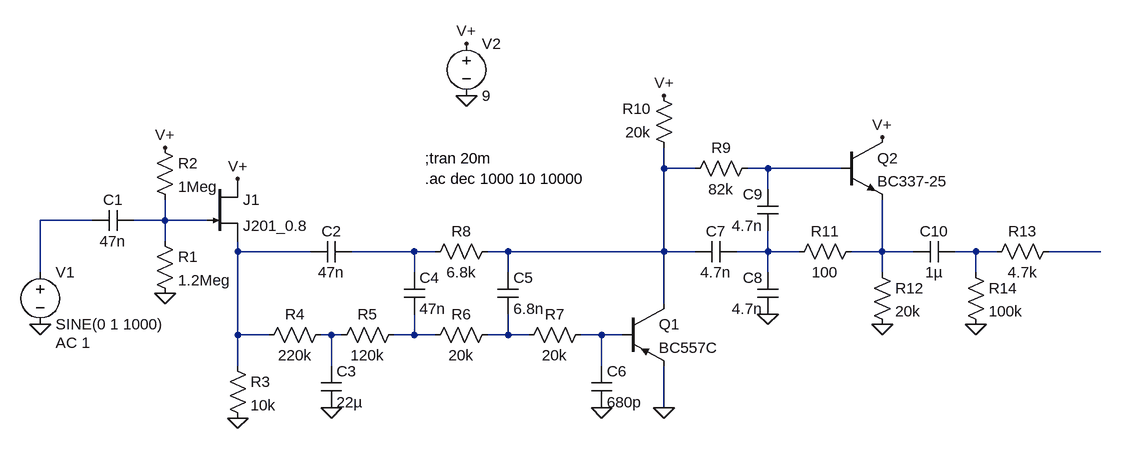
[diagram p0: schematic lart_simple.asc]
lart_simple.asc, the LTspice schematic file:
Version 4
SHEET 1 1700 680
WIRE 1008 -16 1008 -48
WIRE 1056 -16 1008 -16
WIRE 1168 -16 1136 -16
WIRE 1280 -16 1168 -16
WIRE 1168 16 1168 -16
WIRE 128 64 48 64
WIRE 240 64 240 32
WIRE 240 64 192 64
WIRE 304 64 240 64
WIRE 240 96 240 64
WIRE 352 112 352 96
WIRE 464 112 352 112
WIRE 624 112 528 112
WIRE 656 112 624 112
WIRE 768 112 736 112
WIRE 1008 112 1008 -16
WIRE 1008 112 768 112
WIRE 1056 112 1008 112
WIRE 1168 112 1168 80
WIRE 1168 112 1120 112
WIRE 1216 112 1168 112
WIRE 1344 112 1344 32
WIRE 1344 112 1296 112
WIRE 1392 112 1344 112
WIRE 1488 112 1456 112
WIRE 1520 112 1488 112
WIRE 1680 112 1600 112
WIRE 48 144 48 64
WIRE 624 144 624 112
WIRE 768 144 768 112
WIRE 1168 144 1168 112
WIRE 1344 144 1344 112
WIRE 1488 144 1488 112
WIRE 1008 192 1008 112
WIRE 352 240 352 112
WIRE 400 240 352 240
WIRE 496 240 480 240
WIRE 512 240 496 240
WIRE 624 240 624 208
WIRE 624 240 592 240
WIRE 656 240 624 240
WIRE 768 240 768 208
WIRE 768 240 736 240
WIRE 800 240 768 240
WIRE 912 240 880 240
WIRE 944 240 912 240
WIRE 352 288 352 240
WIRE 496 288 496 240
WIRE 912 288 912 240
WIRE 1008 352 1008 288
FLAG 48 224 0
FLAG 240 -48 V+
FLAG 352 0 V+
FLAG 1008 -128 V+
FLAG 1344 -64 V+
FLAG 1488 224 0
FLAG 1344 224 0
FLAG 1168 208 0
FLAG 912 352 0
FLAG 1008 352 0
FLAG 496 352 0
FLAG 352 368 0
FLAG 240 176 0
FLAG 704 -208 V+
FLAG 704 -128 0
SYMBOL voltage 48 128 R0
WINDOW 123 24 124 Left 2
WINDOW 39 0 0 Left 2
SYMATTR InstName V1
SYMATTR Value SINE(0 1 1000)
SYMATTR Value2 AC 1
SYMBOL cap 192 48 R90
WINDOW 0 0 32 VBottom 2
WINDOW 3 32 32 VTop 2
SYMATTR InstName C1
SYMATTR Value 47n
SYMBOL res 224 80 R0
SYMATTR InstName R1
SYMATTR Value 1.2Meg
SYMBOL res 224 -64 R0
SYMATTR InstName R2
SYMATTR Value 1Meg
SYMBOL njf 304 0 R0
SYMATTR InstName J1
SYMATTR Value J201_0.8
SYMBOL res 336 272 R0
SYMATTR InstName R3
SYMATTR Value 10k
SYMBOL cap 528 96 R90
WINDOW 0 0 32 VBottom 2
WINDOW 3 32 32 VTop 2
SYMATTR InstName C2
SYMATTR Value 47n
SYMBOL res 496 224 R90
WINDOW 0 0 56 VBottom 2
WINDOW 3 32 56 VTop 2
SYMATTR InstName R4
SYMATTR Value 220k
SYMBOL res 608 224 R90
WINDOW 0 0 56 VBottom 2
WINDOW 3 32 56 VTop 2
SYMATTR InstName R5
SYMATTR Value 120k
SYMBOL cap 480 288 R0
SYMATTR InstName C3
SYMATTR Value 22µ
SYMBOL cap 608 144 R0
SYMATTR InstName C4
SYMATTR Value 47n
SYMBOL res 752 224 R90
WINDOW 0 0 56 VBottom 2
WINDOW 3 32 56 VTop 2
SYMATTR InstName R6
SYMATTR Value 20k
SYMBOL res 896 224 R90
WINDOW 0 0 56 VBottom 2
WINDOW 3 32 56 VTop 2
SYMATTR InstName R7
SYMATTR Value 20k
SYMBOL cap 752 144 R0
SYMATTR InstName C5
SYMATTR Value 6.8n
SYMBOL res 752 96 R90
WINDOW 0 0 56 VBottom 2
WINDOW 3 32 56 VTop 2
SYMATTR InstName R8
SYMATTR Value 6.8k
SYMBOL cap 896 288 R0
SYMATTR InstName C6
SYMATTR Value 680p
SYMBOL pnp 944 192 R0
SYMATTR InstName Q1
SYMATTR Value BC557C
SYMBOL cap 1120 96 R90
WINDOW 0 0 32 VBottom 2
WINDOW 3 32 32 VTop 2
SYMATTR InstName C7
SYMATTR Value 4.7n
SYMBOL cap 1184 208 R180
WINDOW 0 24 56 Left 2
WINDOW 3 24 8 Left 2
SYMATTR InstName C8
SYMATTR Value 4.7n
SYMBOL cap 1184 80 R180
WINDOW 0 24 56 Left 2
WINDOW 3 24 8 Left 2
SYMATTR InstName C9
SYMATTR Value 4.7n
SYMBOL res 1152 -32 R90
WINDOW 0 0 56 VBottom 2
WINDOW 3 32 56 VTop 2
SYMATTR InstName R9
SYMATTR Value 82k
SYMBOL res 1024 -32 R180
WINDOW 0 36 76 Left 2
WINDOW 3 36 40 Left 2
SYMATTR InstName R10
SYMATTR Value 20k
SYMBOL res 1312 96 R90
WINDOW 0 0 56 VBottom 2
WINDOW 3 32 56 VTop 2
SYMATTR InstName R11
SYMATTR Value 100
SYMBOL npn 1280 -64 R0
SYMATTR InstName Q2
SYMATTR Value BC337-25
SYMBOL res 1328 128 R0
SYMATTR InstName R12
SYMATTR Value 20k
SYMBOL cap 1456 96 R90
WINDOW 0 0 32 VBottom 2
WINDOW 3 32 32 VTop 2
SYMATTR InstName C10
SYMATTR Value 1µ
SYMBOL res 1616 96 R90
WINDOW 0 0 56 VBottom 2
WINDOW 3 32 56 VTop 2
SYMATTR InstName R13
SYMATTR Value 4.7k
SYMBOL res 1472 128 R0
SYMATTR InstName R14
SYMATTR Value 100k
SYMBOL voltage 704 -224 R0
WINDOW 123 0 0 Left 2
WINDOW 39 0 0 Left 2
SYMATTR InstName V2
SYMATTR Value 9
TEXT 640 -32 Left 2 !;tran 20m
TEXT 640 0 Left 2 !.ac dec 1000 10 10000

The netlist it stands for:
* lart_simple.asc
V1 N003 0 SINE(0 1 1000) AC 1
C1 N004 N003 47n
R1 N004 0 1.2Meg
R2 V+ N004 1Meg
J1 V+ N004 N005 J201_0.8
R3 N005 0 10k
C2 N006 N005 47n
R4 N011 N005 220k
R5 N012 N011 120k
C3 N011 0 22µ
C4 N006 N012 47n
R6 N013 N012 20k
R7 N014 N013 20k
C5 N001 N013 6.8n
R8 N001 N006 6.8k
C6 N014 0 680p
Q1 N001 N014 0 0 BC557C
C7 N007 N001 4.7n
C8 0 N007 4.7n
C9 N007 N002 4.7n
R9 N002 N001 82k
R10 N001 V+ 20k
R11 N008 N007 100
Q2 V+ N002 N008 0 BC337-25
R12 N008 0 20k
C10 N009 N008 1µ
R13 N010 N009 4.7k
R14 N009 0 100k
V2 V+ 0 9
.model NPN NPN
.model PNP PNP
.lib standard.bjt
.model NJF NJF
.model PJF PJF
.lib standard.jft
;tran 20m
.ac dec 1000 10 10000
.backanno
.end